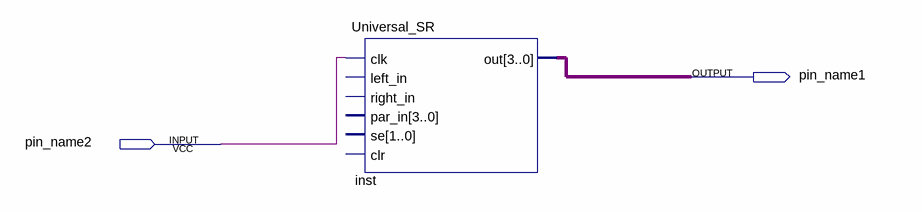
[diagram p0: schematic sheet]
// Quartus schematic Block1.bdf as structural Verilog: 1 symbols, 2 pins
module Block1 (
  input  pin_name2,
  output pin_name1
);

  wire [3:0] inst_out;

  Universal_SR inst (.clk(pin_name2), .out(inst_out));  // open: left_in, right_in, par_in, se, clr
endmodule
